# Altium schematic sheet 08_HDMI.SchDoc
size A4; SheetNumber: 9; SheetTotal: 11
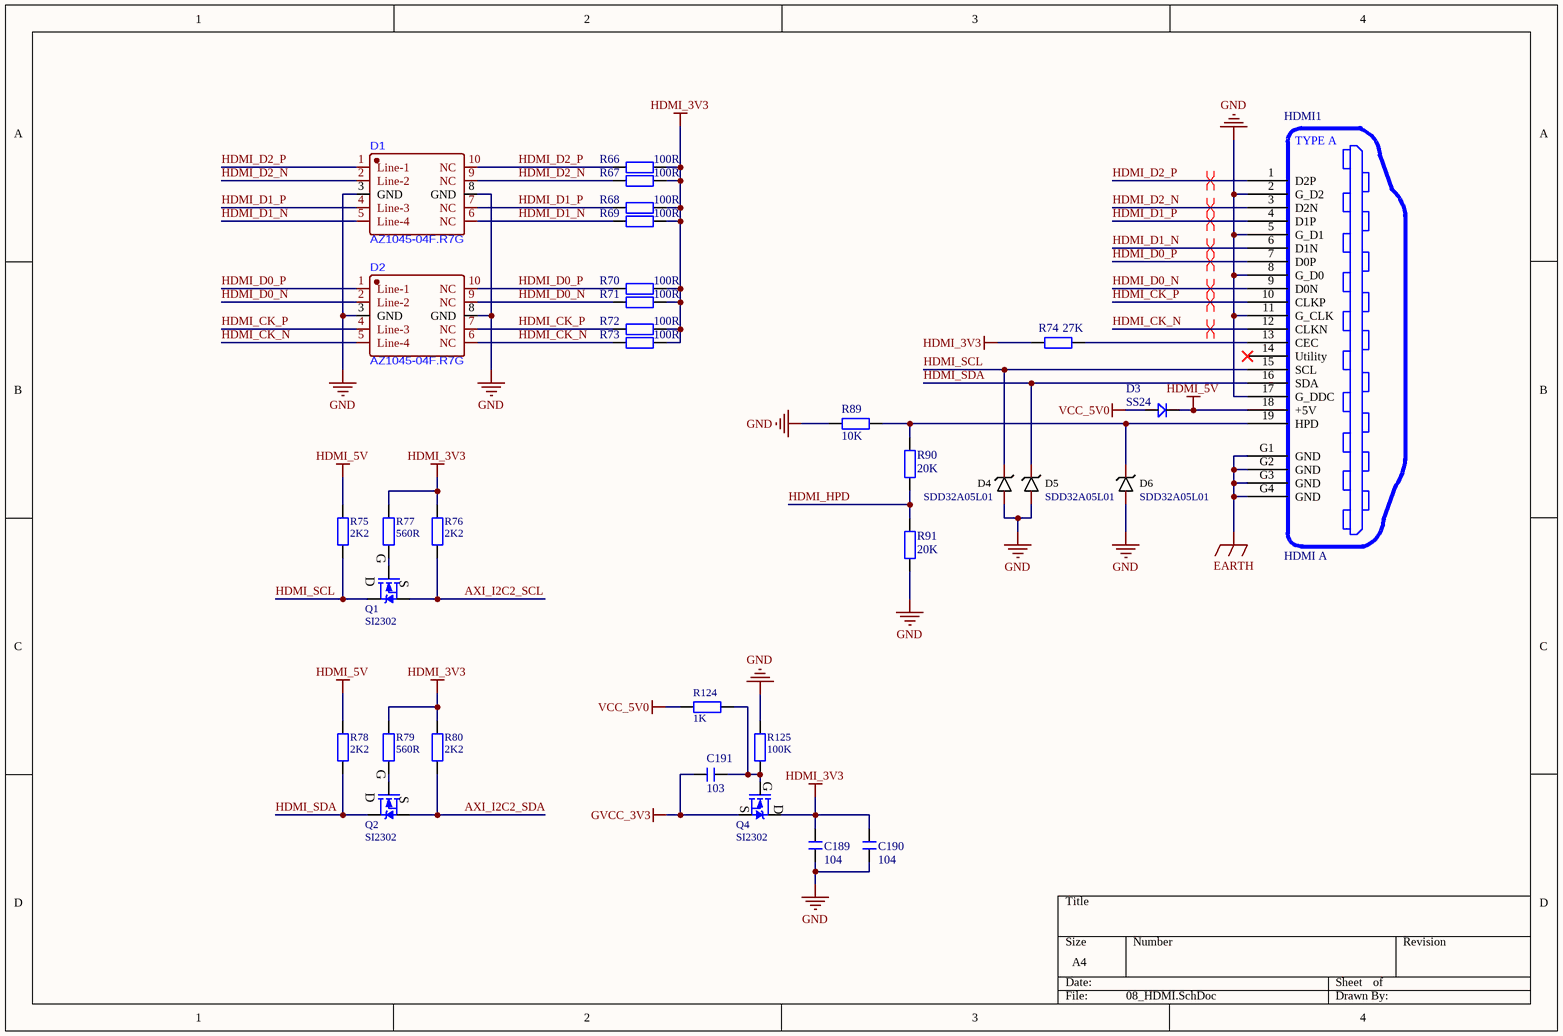
[diagram p0: 08_HDMI.SchDoc]

## Parts
C189  104  [C 0603]
C190  104  [C 0603]
C191  103  [C 0603]
D1  AZ1045-04F.R7G  [AZ1045-04F]
D2  AZ1045-04F.R7G  [AZ1045-04F]
D3  SS24  [SMA]
D4  SDD32A05L01  [SOD-323]
D5  SDD32A05L01  [SOD-323]
D6  SDD32A05L01  [SOD-323]
HDMI1  HDMI A  [HDMI-A]
Q1  SI2302  [SOT23-3L]
Q2  SI2302  [SOT23-3L]
Q4  SI2302  [SOT23-3L]
R66  100R  [R 0402]
R67  100R  [R 0402]
R68  100R  [R 0402]
R69  100R  [R 0402]
R70  100R  [R 0402]
R71  100R  [R 0402]
R72  100R  [R 0402]
R73  100R  [R 0402]
R74  27K  [R 0402]
R75  2K2  [R 0603]
R76  2K2  [R 0603]
R77  560R  [R 0603]
R78  2K2  [R 0603]
R79  560R  [R 0603]
R80  2K2  [R 0603]
R89  10K  [R 0603]
R90  20K  [R 0603]
R91  20K  [R 0603]
R124  1K  [R 0603]
R125  100K  [R 0603]

## Nets
EARTH: HDMI1.G1(GND) HDMI1.G2(GND) HDMI1.G3(GND) HDMI1.G4(GND)
GND: C189.1 C190.1 D1.3(GND) D1.8(GND) D2.3(GND) D2.8(GND) D4.2(A) D5.2(A) D6.2(A) HDMI1.2(G_D2) HDMI1.5(G_D1) HDMI1.8(G_D0) HDMI1.11(G_CLK) HDMI1.17(G_DDC) R89.1 R91.1 R125.2
GVCC_3V3: C191.1 Q4.2(S)
HDMI_3V3: C189.2 C190.2 Q4.3(D) R66.2 R67.2 R68.2 R69.2 R70.2 R71.2 R72.2 R73.2 R74.1 R76.2 R77.2 R79.2 R80.2
HDMI_5V: D3.2(K) HDMI1.18(+5V) R75.2 R78.2
VCC_5V0: D3.1(A) R124.2
AXI_I2C2_SCL: Q1.2(S) R76.1
AXI_I2C2_SDA: Q2.2(S) R80.1
HDMI_CK_N: D2.5(Line-4) D2.6(NC) HDMI1.12(CLKN) R73.1
HDMI_CK_P: D2.4(Line-3) D2.7(NC) HDMI1.10(CLKP) R72.1
HDMI_D0_N: D2.2(Line-2) D2.9(NC) HDMI1.9(D0N) R71.1
HDMI_D0_P: D2.1(Line-1) D2.10(NC) HDMI1.7(D0P) R70.1
HDMI_D1_N: D1.5(Line-4) D1.6(NC) HDMI1.6(D1N) R69.1
HDMI_D1_P: D1.4(Line-3) D1.7(NC) HDMI1.4(D1P) R68.1
HDMI_D2_N: D1.2(Line-2) D1.9(NC) HDMI1.3(D2N) R67.1
HDMI_D2_P: D1.1(Line-1) D1.10(NC) HDMI1.1(D2P) R66.1
HDMI_HPD: R90.1 R91.2
HDMI_SCL: D4.1(C) HDMI1.15(SCL) Q1.3(D) R75.1
HDMI_SDA: D5.1(C) HDMI1.16(SDA) Q2.3(D) R78.1
NetC191_2: C191.2 Q4.1(G) R124.1 R125.1
NetD6_1: D6.1(C) HDMI1.19(HPD) R89.2 R90.2
NetHDMI1_13: HDMI1.13(CEC) R74.2
NetQ1_1: Q1.1(G) R77.1
NetQ2_1: Q2.1(G) R79.1

Not connected (* = marked no-connect by the designer): HDMI1 14(Utility)*

## Layout directives
differential pair: HDMI_CK_N, HDMI_CK_P, HDMI_D0_N, HDMI_D0_P, HDMI_D1_N, HDMI_D1_P, HDMI_D2_N, HDMI_D2_P

## Notes on the sheet
- (in symbol HDMI-A-19P) TYPE A

## Library data of the parts
C189-C191 = C: 无极性贴片电容; 版权归属: 源创客; BOM名称: 无极性贴片电容; 学习资源: www.ooocke.com
D3 = SS14: 肖特基二极管; 版权归属: 源创客; 属性: 40V/1A; BOM名称: 肖特基二极管; 学习资源: www.ooocke.com
D4-D6 = SDD32A05L01: Manufacturer: Brightking(君耀电子); Add into BOM: yes; Polarity: 单向; Number of Lines: 1; Reverse Stand-Off Voltage (Vrwm): 5V; Breakdown Voltage (VBR): 6V; Peak Pulse Current(Ipp)@8/20us: 24A; Clamping Voltage@Ipp: 9.8V; Name: SDD32A05L01; Symbol: SDD32A05L01; Device: SDD32A05L01; LCSC Part Name: 单向ESD; Supplier Part: C313305; Manufacturer Part: SDD32A05L01; Supplier Footprint: SOD-323; JLCPCB Part Class: Extended Part; Datasheet: https://atta.szlcsc.com/upload/public/pdf/source/20181015/C313305_BF914637BD71FE225247645F09645EA8.pdf; Supplier: LCSC; Convert to PCB: yes
HDMI1 = HDMI-A-19P: HDMI座子
Q1 Q2 Q4 = SI2302: N沟道场效应管; 版权归属: 源创客; BOM名称: N沟道场效应管; 学习资源: www.ooocke.com
R66-R80 R89-R91 R124 R125 = R: 贴片电阻; 版权归属: 源创客; BOM名称: 贴片电阻; 学习资源: www.ooocke.com